# EAGLE design rfm69 breakout (EAGLE 7.5.0)
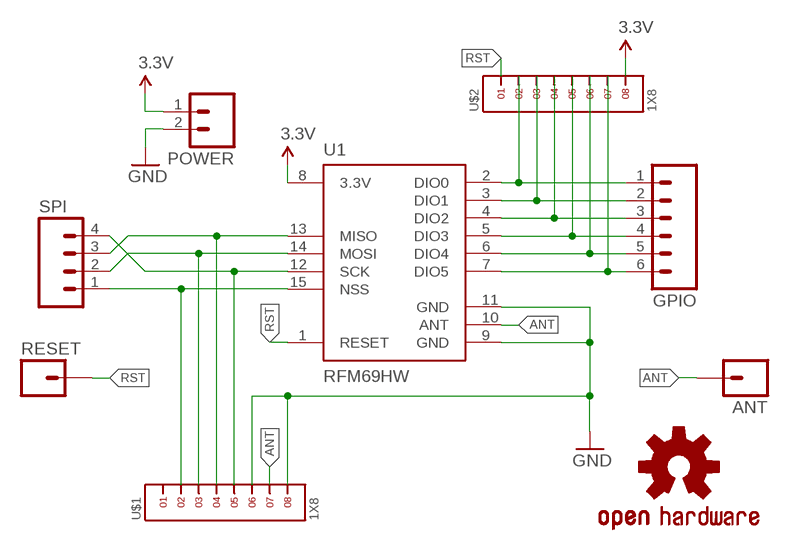
[diagram p0: schematic, sheet 1]

## Parts
ANT  M01PTH  [1X01]
GPIO  M06SILK_FEMALE_PTH  [1X06]
LOGO1  OSHW-LOGOL  [OSHW-LOGO-L]
POWER  M02PTH  [1X02]
RESET  M01PTH  [1X01]
SPI  M04PTH  [1X04]
U1  RFM69HW  [RFM69W-XXXS2]
U$1  1X8  [1X8]
U$2  1X8  [1X8]

## Nets
3.3V: POWER.1 U1.8(3.3V) U$2.8
ANT: ANT.1 U1.10(ANT) U$1.7
GND: POWER.2 U1.9(GND) U1.11(GND) U$1.6 U$1.8
N$1: GPIO.1 U1.2(DIO0) U$2.2
N$2: GPIO.2 U1.3(DIO1) U$2.3
N$3: GPIO.3 U1.4(DIO2) U$2.4
N$4: GPIO.4 U1.5(DIO3) U$2.5
N$5: GPIO.5 U1.6(DIO4) U$2.6
N$6: GPIO.6 U1.7(DIO5) U$2.7
N$8: SPI.1 U1.15(NSS) U$1.2
N$9: SPI.2 U1.14(MOSI) U$1.3
N$10: SPI.3 U1.13(MISO) U$1.4
N$11: SPI.4 U1.12(SCK) U$1.5
RST: RESET.1 U1.1(RESET) U$2.1
Unconnected: U$1.1

## Library data of the parts
ANT RESET = SparkFun-Connectors:M01: Header 1 Standard 1-pin 0.1" header. Use with straight break away headers (SKU : PRT-00116), right angle break away headers (PRT-00553), swiss pins (PRT-00743), machine pins (PRT-00117), and female headers (PRT-00115). SMTSO-256-ET is a "flush mount" nut for a 4-40 screw. The older package used to be too tight, and did not allow it to sit properly thru the drill hit. The latest (0.165DIA) fits nice and snug.; OC_NEWARK: unknown
GPIO = SparkFun-Connectors:M06: Header 6 Standard 6-pin 0.1" header. Use with straight break away headers (SKU : PRT-00116), right angle break away headers (PRT-00553), swiss pins (PRT-00743), machine pins (PRT-00117), and female headers (PRT-00115). Molex polarized connector foot print use with SKU : PRT-08094 with associated crimp pins and housings. NOTES ON THE VARIANTS LOCK and LOCK_LONGPADS... This footprint was designed to help hold the alignment of a through-hole component (i.e. 6-pin header) while soldering it into place. You may notice that each hole has been shifted either up or down by 0.005 of an inch from it's more standard position (which is a perfectly straight line). This slight alteration caused the pins (the squares in the middle) to touch the edges of the holes. Because they are alternating, it causes a "brace" to hold the component in place. 0.005 has proven to be the perfect amount of "off-center" position when using our standard breakaway headers. Although looks a little odd when you look at the bare footprint, once you have a header in there, the alteration is very hard to notice. Also,if you push a header all the way into place, it is covered up entirely on the bottom side. This idea of altering the position of holes to aid alignment will be further integrated into the Sparkfun Library for other footprints. It can help hold any component with 3 or more connection pins.; OC_NEWARK: unknown; PROD_ID: CONN-08437
LOGO1 = SparkFun-Aesthetics:OSHW-LOGO: Open Source Hardware Logo This logo indicates the piece of hardware it is found on incorporates a OSHW license and/or adheres to the definition of open source hardware found here: http://freedomdefined.org/OSHW
POWER = SparkFun-Connectors:M02: Standard 2-pin 0.1" header. Use with - straight break away headers ( PRT-00116) - right angle break away headers (PRT-00553) - swiss pins (PRT-00743) - machine pins (PRT-00117) - female headers (PRT-00115) Molex polarized connector foot print use with: PRT-08233 with associated crimp pins and housings. 2.54_SCREWTERM for use with PRT-10571. 3.5mm Screw Terminal footprints for PRT-08084 5mm Screw Terminal footprints for use with PRT-08432; OC_NEWARK: unknown
SPI = SparkFun-Connectors:M04: Header 4 Standard 4-pin 0.1" header. Use with straight break away headers (SKU : PRT-00116), right angle break away headers (PRT-00553), swiss pins (PRT-00743), machine pins (PRT-00117), and female headers (PRT-00115). Molex polarized connector foot print use with SKU : PRT-08231 with associated crimp pins and housings. 1MM SMD Version SKU: PRT-10208; OC_NEWARK: unknown; PROD_ID: CONN-09696
U1 = SparkFun-RF:RFM69H; OC_NEWARK: unknown
U$1 U$2 = headers(2mm):1X8

## Net classes
0 default: width 0.305 mm, drill 0.508 mm, clearance 0.254 mm
1 OSH Park: width 0.152 mm, drill 0.33 mm, clearance 0.152 mm

## Board
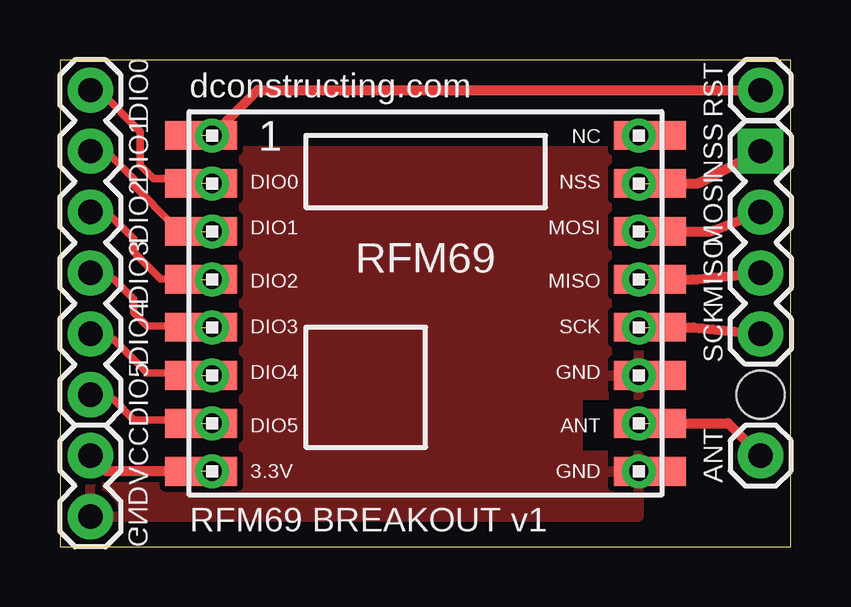
[diagram p1: board, top side]
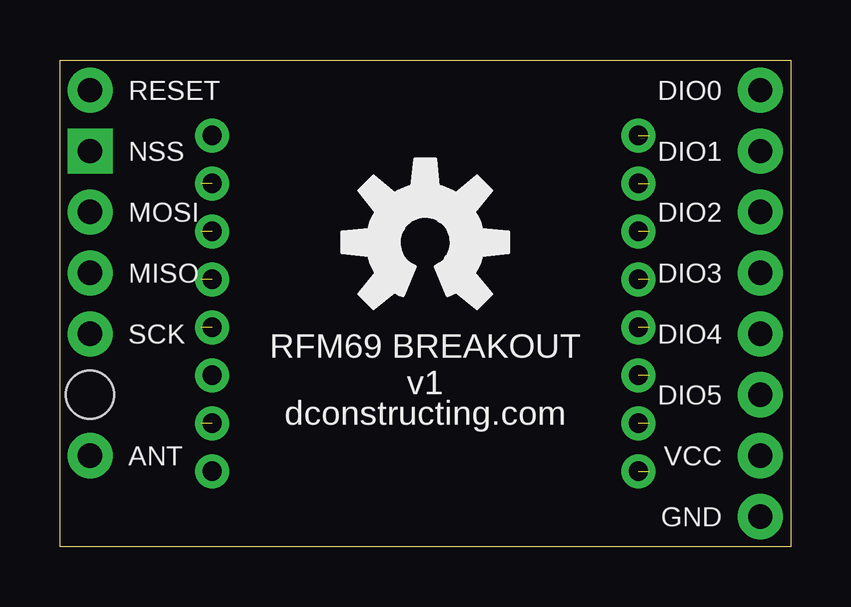
[diagram p2: board, bottom side, seen from below]

Size 30.47 x 20.31 mm. Coordinates in mm from the lower left corner, seen from the top.
Outline: 0,0 30.47,0 30.47,20.31 0,20.31 0,0
Copper layers (1*16): Top 0.0356mm / dielectric 1.5011mm / Bottom 0.0356mm
Design rules "oshpark-2layer *": minimum track width 6mil, minimum drill 13mil, track to track 6mil, track to pad 6mil, pad to pad 6mil, via to via 6mil, smd to smd 0mil, copper to edge 15mil, drill to drill 6mil, minimum pad ring 7mil, minimum via ring 7mil, stop-mask expansion 2.5mil, vias tented up to drill 0mil, thermal gap 10mil
Holes 2 mm at 29.21,6.35

### Footprints (pad centres in the part's own frame; a part is rotated, then mirrored left to right if it is on the bottom)
1X01 = drill 1.016 pad 1.88: 1 0,0
1X06 = drill 1.016 pad 1.88: 1 0,0; 2 2.54,0; 3 5.08,0; 4 7.62,0; 5 10.16,0; 6 12.7,0
1X02 = drill 1.016 pad 1.88: 1 0,0; 2 2.54,0
1X04 = drill 1.016 pad 1.88 square: 1 0,0 | drill 1.016 pad 1.88: 2 2.54,0; 3 5.08,0; 4 7.62,0
RFM69W-XXXS2 = smd 3 x 1.2: 1 -9.35,7; 2 -9.35,5; 3 -9.35,3; 4 -9.35,1; 5 -9.35,-1; 6 -9.35,-3; 7 -9.35,-5; 8 -9.35,-7; 9 9.35,-7; 10 9.35,-5; 11 9.35,-3; 12 9.35,-1; 13 9.35,1; 14 9.35,3; 15 9.35,5; 16 9.35,7
1X8 = drill 0.8 pad 1.422: 1 -7,0; 2 -5,0; 3 -3,0; 4 -1,0; 5 1,0; 6 3,0; 7 5,0; 8 7,0

### Placement (x,y rotation side)
ANT  29.21,3.81 90 top
GPIO  1.27,19.05 270 top
LOGO1  15.24,12.7 0 bottom
POWER  1.27,3.81 270 top
RESET  29.21,19.05 90 top
SPI  29.21,16.51 270 top
U1  15.24,10.16 0 top
U$1  24.13,10.16 270 top
U$2  6.35,10.16 270 top

### Tracks (layer width: path | path; a pad name or v marks a point on that pad's centre or on a via)
3.3V  (1 unrouted)
  Top 0.406: U$2.8 1.92,3.16 POWER.1
ANT  (1 unrouted)
  Top 0.406: U$1.7 27.86,5.16 ANT.1
GND
  pour Top: 1.27,16.51 1.27,1.27 24.13,1.27 24.13,3.81 21.59,3.81 21.59,6.35 24.13,6.35 24.13,16.51
N$1  (1 unrouted)
  Top 0.305: U1.2 5.87,15.37 3.91,15.37 3.35,15.93 3.35,17.32 1.68,19 1.4,19 GPIO.1
N$2  (1 unrouted)
  Top 0.305: U1.3 5.87,13.41 4.75,13.41 3.07,15.09 3.07,15.37 1.96,16.48 1.4,16.48 GPIO.2
N$3  (1 unrouted)
  Top 0.305: GPIO.3 1.96,13.97 3.07,12.85 3.07,12.29 4.19,11.18 5.87,11.18 U1.4
N$4  (1 unrouted)
  Top 0.305: U1.5 5.87,9.22 3.63,9.22 3.07,9.78 3.07,10.34 2.23,11.18 1.4,11.18 GPIO.4
N$5  (1 unrouted)
  Top 0.305: U1.6 5.87,7.26 3.63,7.26 2.23,8.66 1.4,8.66 GPIO.5
N$6  (1 unrouted)
  Top 0.305: U1.7 5.87,5.31 3.07,5.31 2.23,6.15 1.4,6.15 GPIO.6
N$8  (1 unrouted)
  Top 0.406: U$1.2 26.59,15.16 SPI.1
N$9  (1 unrouted)
  Top 0.406: U$1.3 27.13,13.16 SPI.2
N$10  (1 unrouted)
  Top 0.406: U$1.4 26.4,11.16 SPI.3
N$11  (1 unrouted)
  Top 0.406: U$1.5 26.4,9.16 SPI.4
RST  (1 unrouted)
  Top 0.406: U$2.1 8.24,19.05 RESET.1

### Text on the board
tPlace: dconstructing.com | RFM69 | RFM69 BREAKOUT v1
bPlace: RFM69 BREAKOUT / v1 | dconstructing.com
tNames: DIO0 | RST | DIO1 | NC | NSS | DIO0 | NSS | DIO2 | MOSI | DIO1 | MOSI | DIO3 | DIO2 | MISO | MISO | DIO4 | DIO3 | SCK | SCK | DIO4 | GND | DIO5 | DIO5 | ANT | VCC | 3.3V | GND | GND
bNames: DIO0 | RESET | DIO1 | NSS | DIO2 | MOSI | DIO3 | MISO | DIO4 | SCK | DIO5 | VCC | ANT | GND